# EAGLE design CoolBreaker (EAGLE 9.2.2)
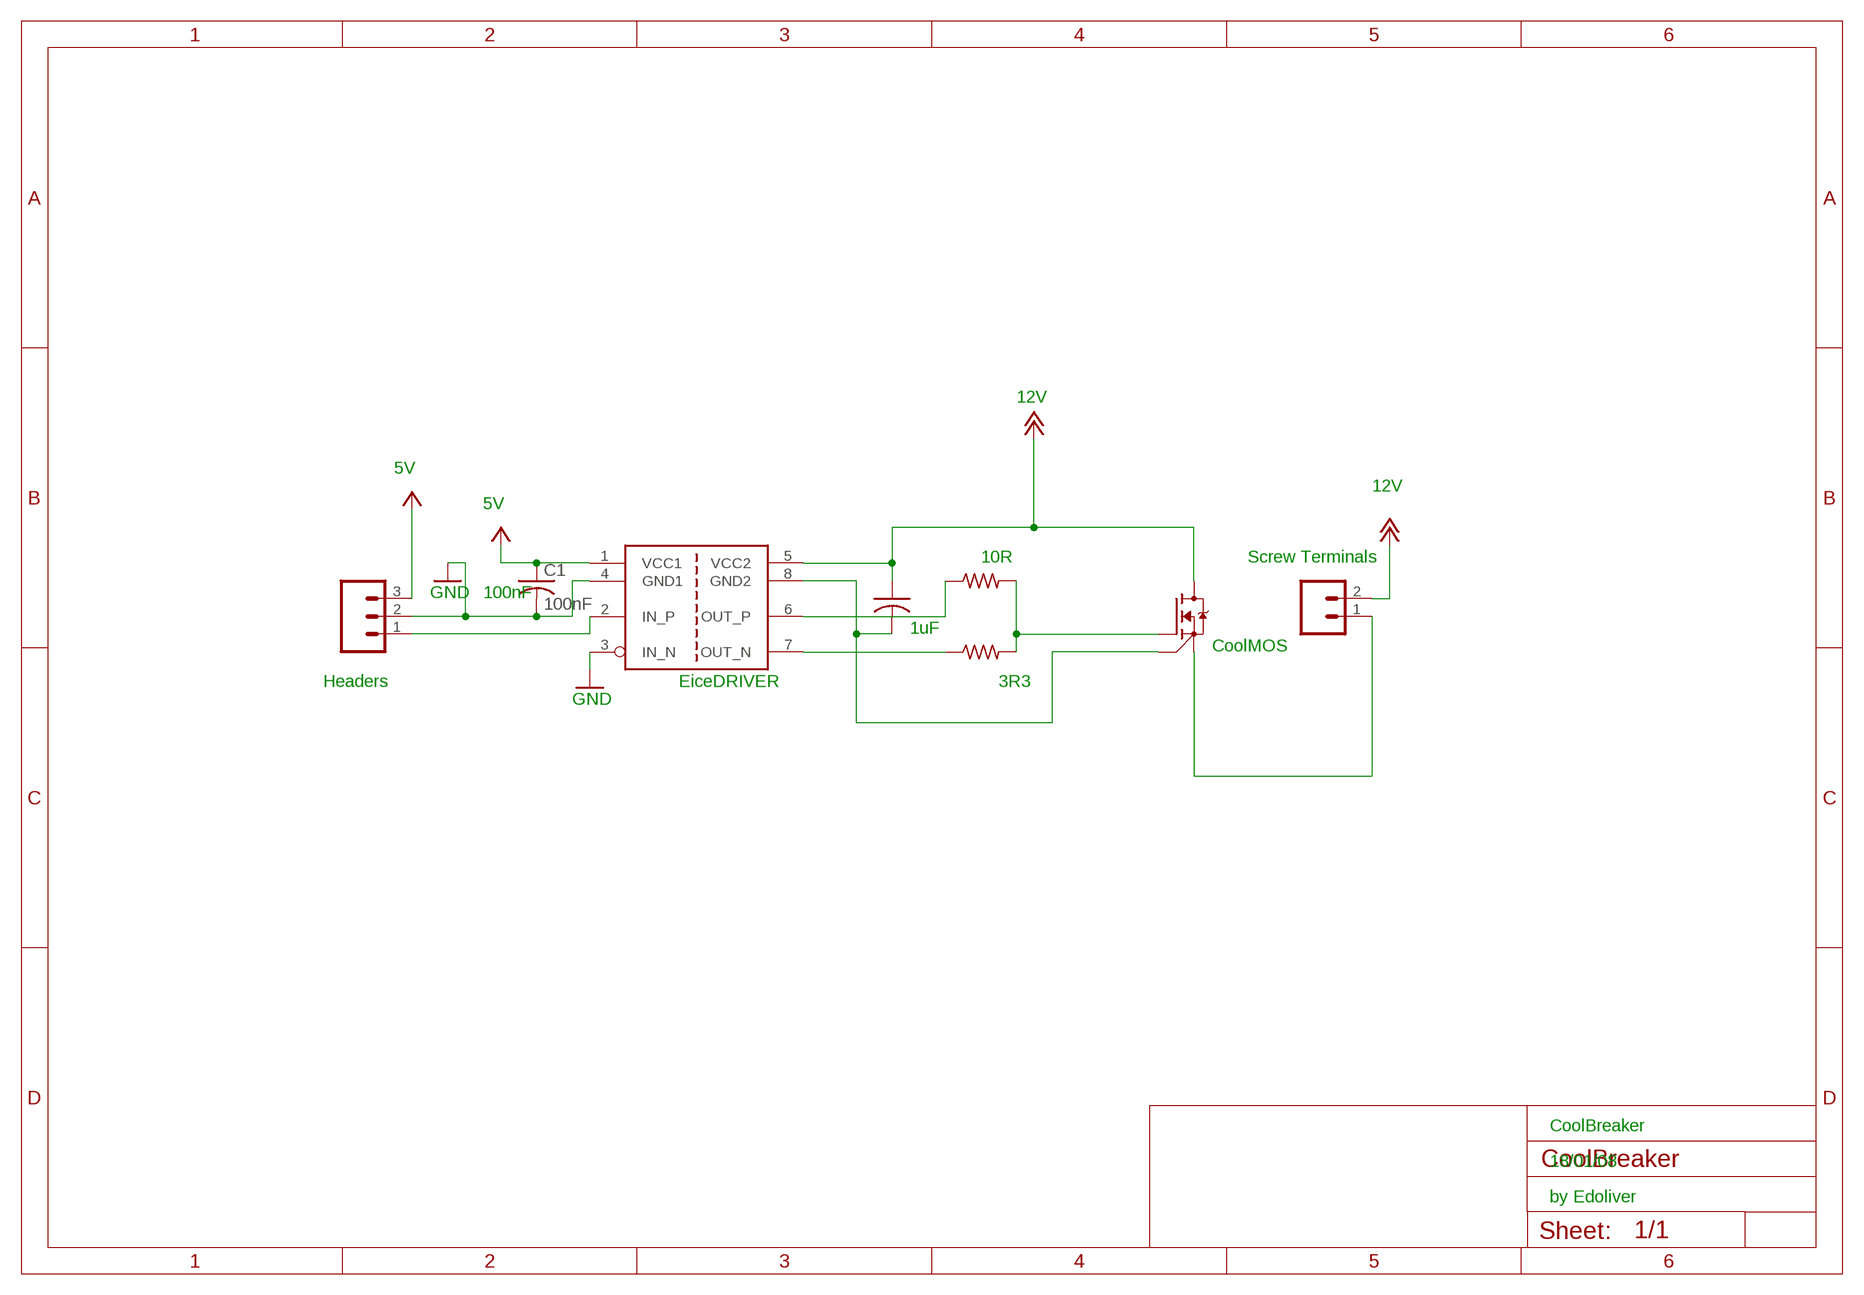
[diagram p0: schematic, sheet 1]

## Parts
C1  100nF  C-US025-024X044  [C025-024X044]
C2  1uF  C-US025-024X044  [C025-024X044]
J1  CONN_025MM  [SCREWTERMINAL-5MM-2]
J2  455-1750-1-ND  CONN_03  [1X03]
Q1  IPT65R033G7XTMA1  [TRANS_IPT65R033G7XTMA1]
R1  3R3  R-US_0204/7  [0204/7]
R2  10R  R-US_0204/7  [0204/7]
U1  1EDI60N12AF  [SOIC127P600X175-8N-10]

## Nets
+5V: C1.1 J2.3 U1.1(VCC1)
+12V: C2.1 J1.2 Q1.9(DRAIN) U1.5(VCC2)
GND: C1.2 J2.2 U1.3(IN_N) U1.4(GND1)
N$2: C2.2 Q1.2(DRIVER_SOURCE) U1.8(GND2)
N$4: R2.1 U1.6(OUT_P)
N$5: R1.1 U1.7(OUT_N)
N$6: Q1.1(GATE) R1.2 R2.2
N$11: J2.1 U1.2(IN_P)
N$12: J1.1 Q1.3(SOURCE) Q1.4(SOURCE) Q1.5(SOURCE) Q1.6(SOURCE) Q1.7(SOURCE) Q1.8(SOURCE)

## Notes on the sheet
- 12V
- 5V
- 12V
- 5V
- 10R | Screw Terminals
- GND | 100nF
- 1uF
- CoolMOS
- Headers | EiceDRIVER | 3R3
- GND
- CoolBreaker
- 18/01/08
- by Edoliver

## Library data of the parts
C1 C2 = rcl:C-US: CAPACITOR, American symbol; SPICEPREFIX: C
J1 = SparkFun-Connectors:CONN_02: Multi connection point. Often used as Generic Header-pin footprint for 0.1 inch spaced/style header connections On any of the 0.1 inch spaced packages, you can populate with these: Break Away Headers - Straight <https://www.sparkfun.com/products/116> (PRT-00116) Break Away Male Headers - Right Angle <https://www.sparkfun.com/products/553> (PRT-00553) Female Headers <https://www.sparkfun.com/products/115> (PRT-00115) Break Away Headers - Machine Pin <https://www.sparkfun.com/products/117> (PRT-00117) Break Away Female Headers - Swiss Machine Pin <https://www.sparkfun.com/products/743> (PRT-00743) For SCREWTERMINALS and SPRING TERMINALS visit here: Screw Terimnals on SparkFun.com <https://www.sparkfun.com/search/results?term=Screw+Terminals> (5mm/3.5mm/2.54mm spacing) This device is also useful as a general connection point to wire up your design to another part of your project. Our various solder wires solder well into these plated through hole pads. Hook-Up Wire - Assortment (Stranded, 22 AWG) <https://www.sparkfun.com/products/11375> (PRT-11375) Hook-Up Wire - Assortment (Solid Core, 22 AWG) <https://www.sparkfun.com/products/11367> (PRT-11367) View the entire wire category on our website here <https://www.sparkfun.com/categories/141> Special notes: Molex polarized connector foot print use with: PRT-08233 with associated crimp pins and housings. 2.54_SCREWTERM for use with PRT-10571. 3.5mm Screw Terminal footprints for PRT-08084 5mm Screw Terminal footprints for use with PRT-08432; SF_SKU: PRT-08432
J2 = SparkFun-Connectors:CONN_03: Multi connection point. Often used as Generic Header-pin footprint for 0.1 inch spaced/style header connections On any of the 0.1 inch spaced packages, you can populate with these: Break Away Headers - Straight <https://www.sparkfun.com/products/116> (PRT-00116) Break Away Male Headers - Right Angle <https://www.sparkfun.com/products/553> (PRT-00553) Female Headers <https://www.sparkfun.com/products/115> (PRT-00115) Break Away Headers - Machine Pin <https://www.sparkfun.com/products/117> (PRT-00117) Break Away Female Headers - Swiss Machine Pin <https://www.sparkfun.com/products/743> (PRT-00743) Stackable Header - 3 Pin (Female, 0.1") <https://www.sparkfun.com/products/13875> (PRT-13875) For SCREWTERMINALS and SPRING TERMINALS visit here: Screw Terimnals on SparkFun.com <https://www.sparkfun.com/search/results?term=Screw+Terminals> (5mm/3.5mm/2.54mm spacing) This device is also useful as a general connection point to wire up your design to another part of your project. Our various solder wires solder well into these plated through hole pads. Hook-Up Wire - Assortment (Stranded, 22 AWG) <https://www.sparkfun.com/products/11375> (PRT-11375) Hook-Up Wire - Assortment (Solid Core, 22 AWG) <https://www.sparkfun.com/products/11367> (PRT-11367) View the entire wire category on our website here <https://www.sparkfun.com/categories/141> Special notes: Molex polarized connector foot print use with SKU : PRT-08232 with associated crimp pins and housings.; PROD_ID: XXX-00000
Q1 = IPT65R033G7XTMA1:IPT65R033G7XTMA1: MOS Power Transistors HV (>= 200V); AVAILABILITY: Unavailable; DESCRIPTION: Trans MOSFET N-CH 650V 69A 9-Pin_8+Tab_ HSOF T/R; MF: Infineon Technologies; MP: IPT65R033G7XTMA1; PACKAGE: PowerSFN-8 Infineon Technologies; PRICE: None
R1 R2 = rcl:R-US_: RESISTOR, American symbol; SPICEPREFIX: R
U1 = 1EDI60N12AF:1EDI60N12AF: 1EDI60N12AF 1EDI EiceDRIVER Compact,Separate output variant for MOSFET,Single Channel MOSFET Gate Driver IC SOIC127P600X175-8N-10

## Net classes
0 default: width 0.254 mm, clearance 0.305 mm

## Board
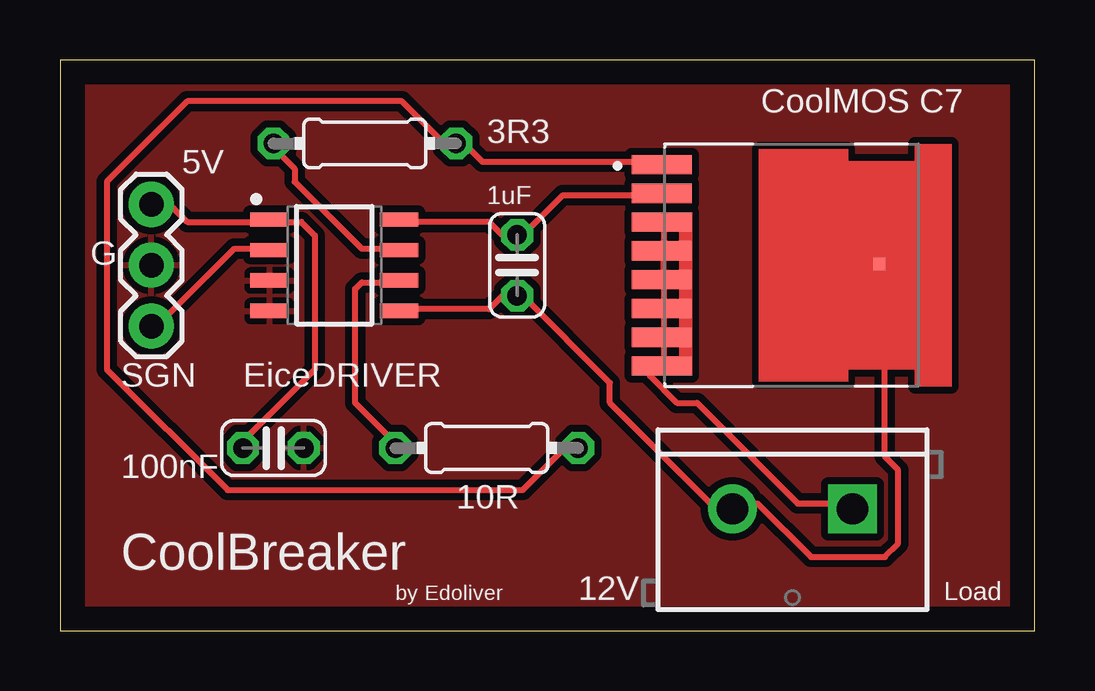
[diagram p1: board, top side]

Size 40.62 x 23.8 mm. Coordinates in mm from the lower left corner, seen from the top.
Outline: 0,0 40.62,0 40.62,23.8 0,23.8 0,0
Copper layers (1*16): Top 0.035mm / dielectric 1.5mm / Bottom 0.035mm
Design rules "default": minimum track width 6mil, minimum drill 0.35mm, track to track 6mil, track to pad 6mil, pad to pad 6mil, via to via 6mil, smd to smd 6mil, copper to edge 40mil, drill to drill 6mil, minimum pad ring 10mil, minimum via ring 8mil, stop-mask expansion 4mil, vias tented up to drill 0mil, thermal gap 10mil

### Footprints (pad centres in the part's own frame; a part is rotated, then mirrored left to right if it is on the bottom)
C025-024X044 = drill 0.813 octagon: 1 -1.27,0; 2 1.27,0
SCREWTERMINAL-5MM-2 = drill 1.3 pad 2.032 square: 1 0,0 | drill 1.3 pad 2.032: 2 5,0
1X03 = drill 1.016 pad 1.88: 1 0,0; 2 2.54,0; 3 5.08,0
TRANS_IPT65R033G7XTMA1 = smd 2.5 x 0.8: 1 -5.4,4.2; 2 -5.4,3; 3 -5.4,1.8; 4 -5.4,0.6; 5 -5.4,-0.6; 6 -5.4,-1.8; 7 -5.4,-3; 8 -5.4,-4.2 | smd 0.5 x 0.5: 9 3.665,0.05
0204/7 = drill 0.813 octagon: 1 -3.81,0; 2 3.81,0
SOIC127P600X175-8N-10 = smd 1.6 x 0.6: 1 -2.7,1.905; 2 -2.7,0.635; 3 -2.7,-0.635; 4 -2.7,-1.905; 5 2.7,-1.905; 6 2.7,-0.635; 7 2.7,0.635; 8 2.7,1.905

### Placement (x,y rotation side)
C1  8.89,7.62 0 top
C2  19.05,15.24 90 top
J1  33.02,5.08 180 top
J2  3.81,12.7 90 top
Q1  30.48,15.24 0 top
R1  12.7,20.32 0 top
R2  17.78,7.62 0 top
U1  11.43,15.24 0 top

### Tracks (layer width: path | path; a pad name or v marks a point on that pad's centre or on a via)
+5V
  Top 0.254: J2.3 3.91,17.6 4.75,17.6 5.31,17.04 8.66,17.04 U1.1 8.94,17.04 10.06,17.04 10.62,16.48 10.62,10.9 7.82,8.1 7.82,7.82 C1.1
+12V
  Top 0.254: U1.5 14.25,13.41 17.88,13.41 18.44,13.97 C2.1 19.28,13.97 22.91,10.34 22.91,9.5 27.1,5.31 27.94,5.31 J1.2 28.22,5.31 29.06,5.31 31.29,3.07 34.37,3.07 34.92,3.63 34.92,6.71 34.37,7.26 34.37,15.09 Q1.9
GND
  pour Top: 0,24.13 40.64,24.13 40.64,0 0,0
N$2
  Top 0.254: U1.8 14.25,17.04 17.88,17.04 18.44,16.48 19,16.48 C2.2 19.28,16.48 19.56,16.48 19.56,16.76 20.95,18.16 24.87,18.16 Q1.2
N$4
  Top 0.254: U1.6 13.97,14.53 12.57,14.53 12.29,14.25 12.29,9.5 13.69,8.1 13.69,7.82 13.97,7.54 R2.1
N$5
  Top 0.254: U1.7 13.97,15.93 12.57,15.93 9.78,18.72 9.78,19.28 9.22,19.84 8.94,19.84 8.66,20.12 R1.1
N$6
  Top 0.254: Q1.1 24.87,19.56 17.6,19.56 16.76,20.4 R1.2 16.48,20.4 15.93,20.4 14.25,22.07 5.31,22.07 1.96,18.72 1.96,10.9 6.99,5.87 19.28,5.87 20.95,7.54 21.51,7.54 R2.2
N$11
  Top 0.254: U1.2 8.66,15.93 7.26,15.93 3.91,12.57 J2.1
N$12
  Top 0.254: Q1.3 25.15,16.76 25.15,15.93 Q1.4 25.15,15.65 25.15,14.81 Q1.5 25.15,14.53 25.15,13.69 Q1.6 25.15,13.41 25.15,12.29 Q1.7 25.15,12.01 25.15,11.18 Q1.8 24.87,11.18 24.59,10.9 24.59,10.62 25.7,9.5 26.54,9.5 30.73,5.31 32.97,5.31 J1.1

### Text on the board
tPlace: CoolMOS C7 | 3R3 | 5V | 1uF | G | SGN | EiceDRIVER | 100nF | 10R | CoolBreaker | by Edoliver | 12V | Load